# Altium schematic sheet BlockDiagram.SchDoc: Block Diagram
size A4; Organization: Gateway; Address1: University of Colorado; Address2: Boulder; DocumentNumber: 1; Revision: 1; SheetNumber: 1; SheetTotal: 6
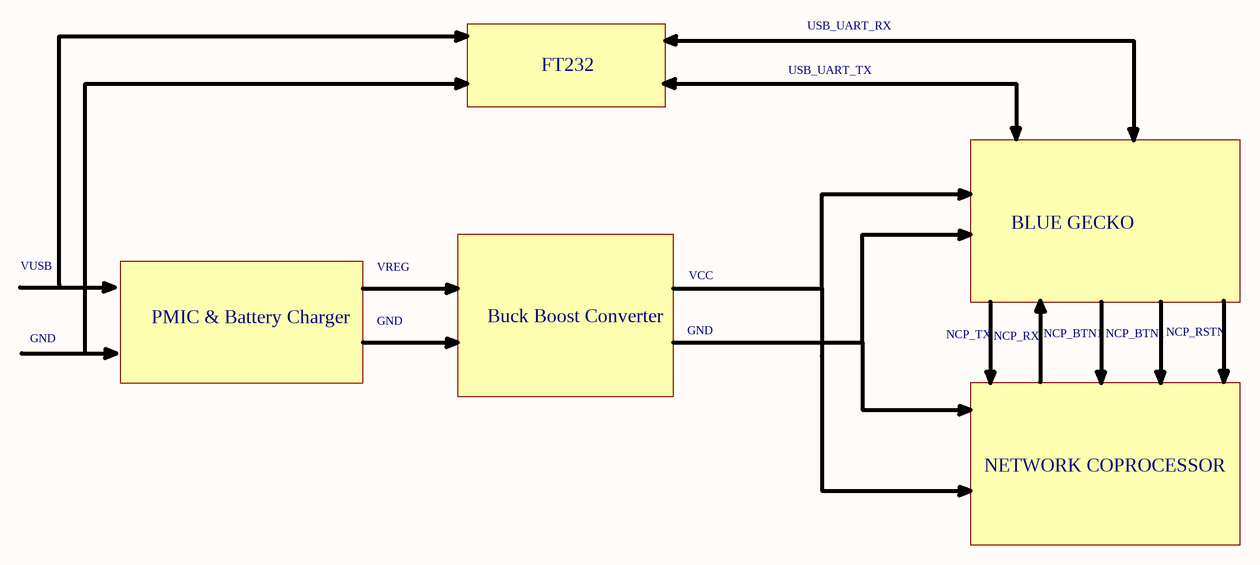
[diagram p0: BlockDiagram.SchDoc]

## Notes on the sheet
- USB_UART_RX
- FT232
- USB_UART_TX
- BLUE GECKO
- VUSB
- PMIC & Battery Charger
- VREG
- GND
- Buck Boost Converter
- VCC
- NCP_TX
- NCP_RX
- NCP_BTN1
- NCP_RSTN
- NETWORK COPROCESSOR
- Title
- Size:
- Date:
- A4
- Number:
- Time:
- Revision:
- Sheet
- of
- File: